# Altium schematic sheet Channel_Switcher.SchDoc
size A; SheetNumber: 1; SheetTotal: 1
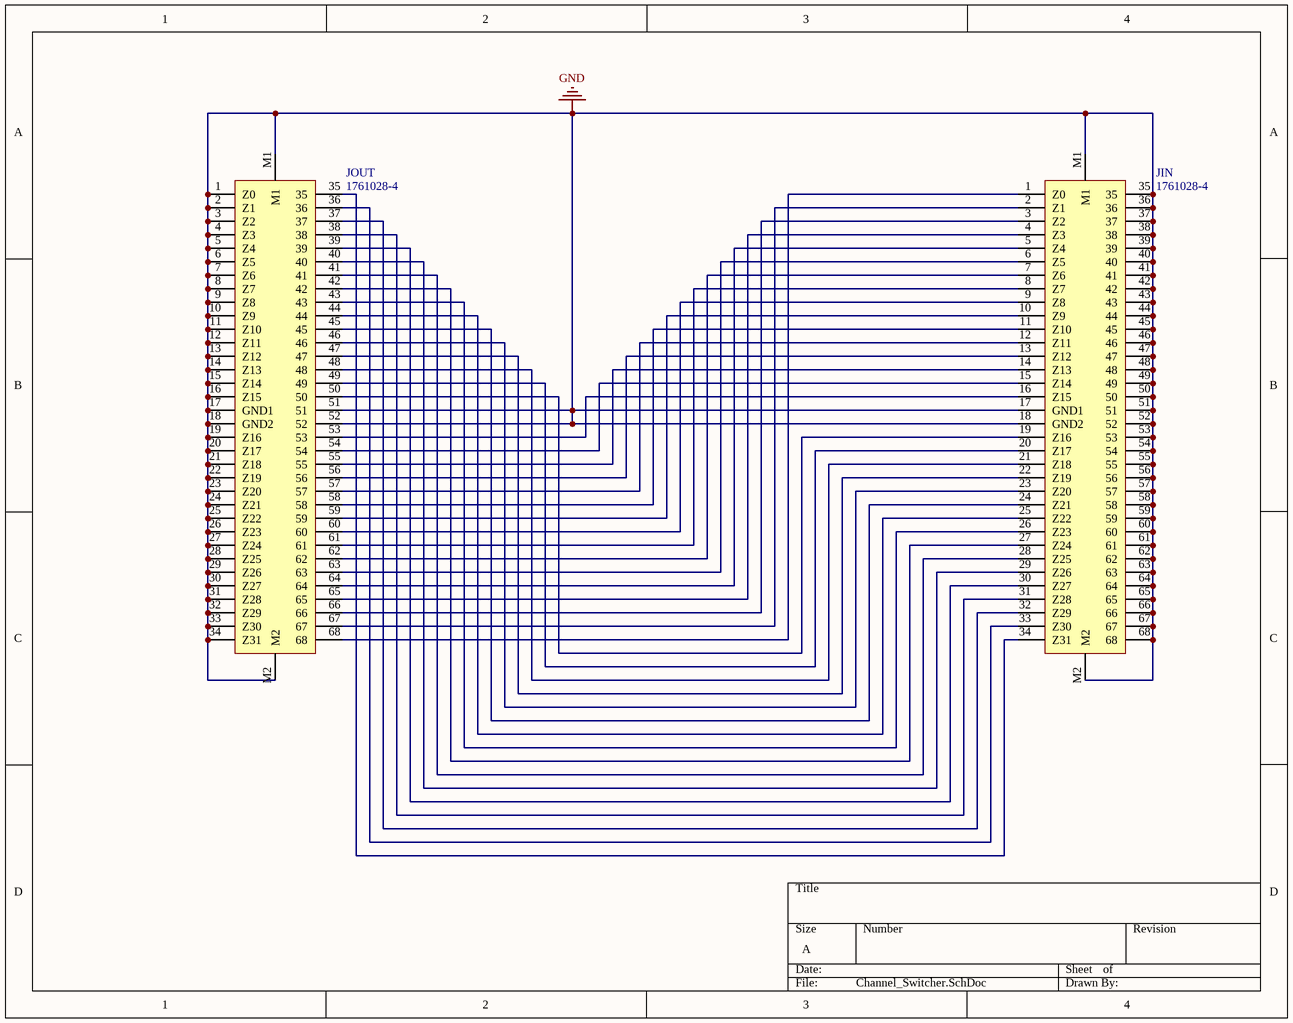
[diagram p0: Channel_Switcher.SchDoc]

## Parts
JIN  1761028-4  [1761028-4-Footprint-1]
JOUT  1761028-4  [1761028-4-Footprint-1]

## Nets
GND: JIN.17(GND1) JIN.18(GND2) JIN.35 JIN.36 JIN.37 JIN.38 JIN.39 JIN.40 JIN.41 JIN.42 JIN.43 JIN.44 JIN.45 JIN.46 JIN.47 JIN.48 JIN.49 JIN.50 JIN.51 JIN.52 JIN.53 JIN.54 JIN.55 JIN.56 JIN.57 JIN.58 JIN.59 JIN.60 JIN.61 JIN.62 JIN.63 JIN.64 JIN.65 JIN.66 JIN.67 JIN.68 JIN.M1 JIN.M2 JOUT.1(Z0) JOUT.2(Z1) JOUT.3(Z2) JOUT.4(Z3) JOUT.5(Z4) JOUT.6(Z5) JOUT.7(Z6) JOUT.8(Z7) JOUT.9(Z8) JOUT.10(Z9) JOUT.11(Z10) JOUT.12(Z11) JOUT.13(Z12) JOUT.14(Z13) JOUT.15(Z14) JOUT.16(Z15) JOUT.17(GND1) JOUT.18(GND2) JOUT.19(Z16) JOUT.20(Z17) JOUT.21(Z18) JOUT.22(Z19) JOUT.23(Z20) JOUT.24(Z21) JOUT.25(Z22) JOUT.26(Z23) JOUT.27(Z24) JOUT.28(Z25) JOUT.29(Z26) JOUT.30(Z27) JOUT.31(Z28) JOUT.32(Z29) JOUT.33(Z30) JOUT.34(Z31) JOUT.51 JOUT.52 JOUT.M1 JOUT.M2
NetJIN_1: JIN.1(Z0) JOUT.68
NetJIN_2: JIN.2(Z1) JOUT.67
NetJIN_3: JIN.3(Z2) JOUT.66
NetJIN_4: JIN.4(Z3) JOUT.65
NetJIN_5: JIN.5(Z4) JOUT.64
NetJIN_6: JIN.6(Z5) JOUT.63
NetJIN_7: JIN.7(Z6) JOUT.62
NetJIN_8: JIN.8(Z7) JOUT.61
NetJIN_9: JIN.9(Z8) JOUT.60
NetJIN_10: JIN.10(Z9) JOUT.59
NetJIN_11: JIN.11(Z10) JOUT.58
NetJIN_12: JIN.12(Z11) JOUT.57
NetJIN_13: JIN.13(Z12) JOUT.56
NetJIN_14: JIN.14(Z13) JOUT.55
NetJIN_15: JIN.15(Z14) JOUT.54
NetJIN_16: JIN.16(Z15) JOUT.53
NetJIN_19: JIN.19(Z16) JOUT.50
NetJIN_20: JIN.20(Z17) JOUT.49
NetJIN_21: JIN.21(Z18) JOUT.48
NetJIN_22: JIN.22(Z19) JOUT.47
NetJIN_23: JIN.23(Z20) JOUT.46
NetJIN_24: JIN.24(Z21) JOUT.45
NetJIN_25: JIN.25(Z22) JOUT.44
NetJIN_26: JIN.26(Z23) JOUT.43
NetJIN_27: JIN.27(Z24) JOUT.42
NetJIN_28: JIN.28(Z25) JOUT.41
NetJIN_29: JIN.29(Z26) JOUT.40
NetJIN_30: JIN.30(Z27) JOUT.39
NetJIN_31: JIN.31(Z28) JOUT.38
NetJIN_32: JIN.32(Z29) JOUT.37
NetJIN_33: JIN.33(Z30) JOUT.36
NetJIN_34: JIN.34(Z31) JOUT.35

## Library data of the parts
JIN JOUT = CMP-002-00071-1: Telecom and Datacom Connector, 68 Contact(s), Female, Right Angle, Solder Terminal, #2-56, Receptacle; Connector Type: TELECOM AND DATACOM CONNECTOR; Mounting Technology: Panel,Board; Max Operating Temperature: 105°C; Min Operating Temperature: -55°C; RoHS Compliant: Yes